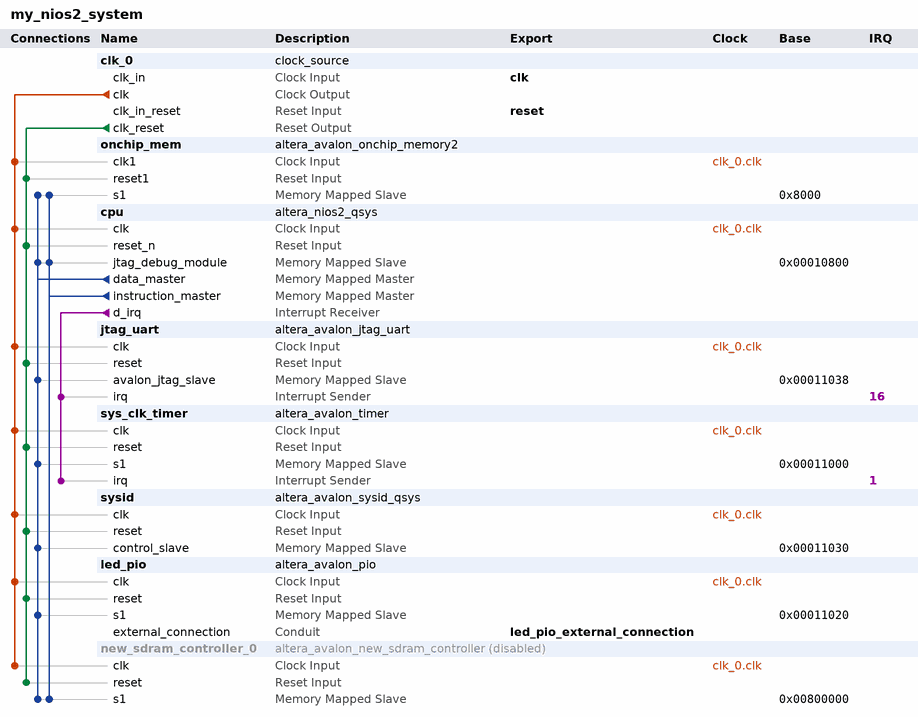
[diagram p0: system contents]
# Platform Designer (Qsys) system my_nios2_system, Cyclone III EP3C16F484C6
# Parameters at their usual value, and those the tool derives, are not listed.
package require -exact qsys 13.1
create_system my_nios2_system
set_project_property DEVICE_FAMILY {Cyclone III}
set_project_property DEVICE EP3C16F484C6

add_instance clk_0 clock_source 13.1
set_instance_parameter_value clk_0 clockFrequency 50000000

add_instance onchip_mem altera_avalon_onchip_memory2 13.1
set_instance_parameter_value onchip_mem dataWidth 32
set_instance_parameter_value onchip_mem dualPort false
set_instance_parameter_value onchip_mem initMemContent true
set_instance_parameter_value onchip_mem initializationFileName onchip_mem.hex
set_instance_parameter_value onchip_mem memorySize 20480

add_instance cpu altera_nios2_qsys 13.1
set_instance_parameter_value cpu resetSlave onchip_mem.s1
set_instance_parameter_value cpu mmu_TLBMissExcSlave None
set_instance_parameter_value cpu exceptionSlave onchip_mem.s1
set_instance_parameter_value cpu breakSlave cpu.jtag_debug_module
set_instance_parameter_value cpu muldiv_multiplierType NoneSmall
set_instance_parameter_value cpu impl Small
set_instance_parameter_value cpu icache_size 2048

add_instance jtag_uart altera_avalon_jtag_uart 13.1
set_instance_parameter_value jtag_uart simInteractiveOptions NO_INTERACTIVE_WINDOWS

add_instance sys_clk_timer altera_avalon_timer 13.1
set_instance_parameter_value sys_clk_timer period 1
set_instance_parameter_value sys_clk_timer periodUnits MSEC

add_instance sysid altera_avalon_sysid_qsys 13.1
set_instance_parameter_value sysid id 0

add_instance led_pio altera_avalon_pio 13.1
set_instance_parameter_value led_pio direction Output
set_instance_parameter_value led_pio width 8

add_instance new_sdram_controller_0 altera_avalon_new_sdram_controller 13.1
set_instance_property new_sdram_controller_0 ENABLED false
set_instance_parameter_value new_sdram_controller_0 TAC 5.5
set_instance_parameter_value new_sdram_controller_0 TRCD 20.0
set_instance_parameter_value new_sdram_controller_0 TRP 20.0
set_instance_parameter_value new_sdram_controller_0 casLatency 3
set_instance_parameter_value new_sdram_controller_0 columnWidth 8
set_instance_parameter_value new_sdram_controller_0 dataWidth 16
set_instance_parameter_value new_sdram_controller_0 generateSimulationModel false
set_instance_parameter_value new_sdram_controller_0 model single_Micron_MT48LC4M32B2_7_chip
set_instance_parameter_value new_sdram_controller_0 numberOfBanks 4
set_instance_parameter_value new_sdram_controller_0 numberOfChipSelects 1
set_instance_parameter_value new_sdram_controller_0 powerUpDelay 100.0
set_instance_parameter_value new_sdram_controller_0 refreshPeriod 15.625
set_instance_parameter_value new_sdram_controller_0 rowWidth 12

# connections
add_connection clk_0.clk cpu.clk clock
add_connection clk_0.clk jtag_uart.clk clock
add_connection clk_0.clk led_pio.clk clock
add_connection clk_0.clk new_sdram_controller_0.clk clock
add_connection clk_0.clk onchip_mem.clk1 clock
add_connection clk_0.clk sys_clk_timer.clk clock
add_connection clk_0.clk sysid.clk clock
add_connection clk_0.clk_reset cpu.reset_n reset
add_connection clk_0.clk_reset jtag_uart.reset reset
add_connection clk_0.clk_reset led_pio.reset reset
add_connection clk_0.clk_reset new_sdram_controller_0.reset reset
add_connection clk_0.clk_reset onchip_mem.reset1 reset
add_connection clk_0.clk_reset sys_clk_timer.reset reset
add_connection clk_0.clk_reset sysid.reset reset
add_connection cpu.data_master cpu.jtag_debug_module avalon
set_connection_parameter_value cpu.data_master/cpu.jtag_debug_module baseAddress 0x00010800
add_connection cpu.data_master jtag_uart.avalon_jtag_slave avalon
set_connection_parameter_value cpu.data_master/jtag_uart.avalon_jtag_slave baseAddress 0x00011038
add_connection cpu.data_master led_pio.s1 avalon
set_connection_parameter_value cpu.data_master/led_pio.s1 baseAddress 0x00011020
add_connection cpu.data_master new_sdram_controller_0.s1 avalon
set_connection_parameter_value cpu.data_master/new_sdram_controller_0.s1 baseAddress 0x00800000
add_connection cpu.data_master onchip_mem.s1 avalon
set_connection_parameter_value cpu.data_master/onchip_mem.s1 baseAddress 0x8000
add_connection cpu.data_master sys_clk_timer.s1 avalon
set_connection_parameter_value cpu.data_master/sys_clk_timer.s1 baseAddress 0x00011000
add_connection cpu.data_master sysid.control_slave avalon
set_connection_parameter_value cpu.data_master/sysid.control_slave baseAddress 0x00011030
add_connection cpu.instruction_master cpu.jtag_debug_module avalon
set_connection_parameter_value cpu.instruction_master/cpu.jtag_debug_module baseAddress 0x00010800
add_connection cpu.instruction_master new_sdram_controller_0.s1 avalon
set_connection_parameter_value cpu.instruction_master/new_sdram_controller_0.s1 baseAddress 0x00800000
add_connection cpu.instruction_master onchip_mem.s1 avalon
set_connection_parameter_value cpu.instruction_master/onchip_mem.s1 baseAddress 0x8000
add_connection cpu.d_irq jtag_uart.irq interrupt
set_connection_parameter_value cpu.d_irq/jtag_uart.irq irqNumber 16
add_connection cpu.d_irq sys_clk_timer.irq interrupt
set_connection_parameter_value cpu.d_irq/sys_clk_timer.irq irqNumber 1

# exported interfaces
add_interface clk clock sink
set_interface_property clk EXPORT_OF clk_0.clk_in
add_interface reset reset sink
set_interface_property reset EXPORT_OF clk_0.clk_in_reset
add_interface led_pio_external_connection conduit end
set_interface_property led_pio_external_connection EXPORT_OF led_pio.external_connection

set_interconnect_requirement {$system} qsys_mm.clockCrossingAdapter HANDSHAKE
set_interconnect_requirement {$system} qsys_mm.maxAdditionalLatency 1
set_interconnect_requirement {$system} qsys_mm.insertDefaultSlave false

save_system my_nios2_system.qsys
